# EAGLE design adc_breakout (EAGLE 9.5.2)
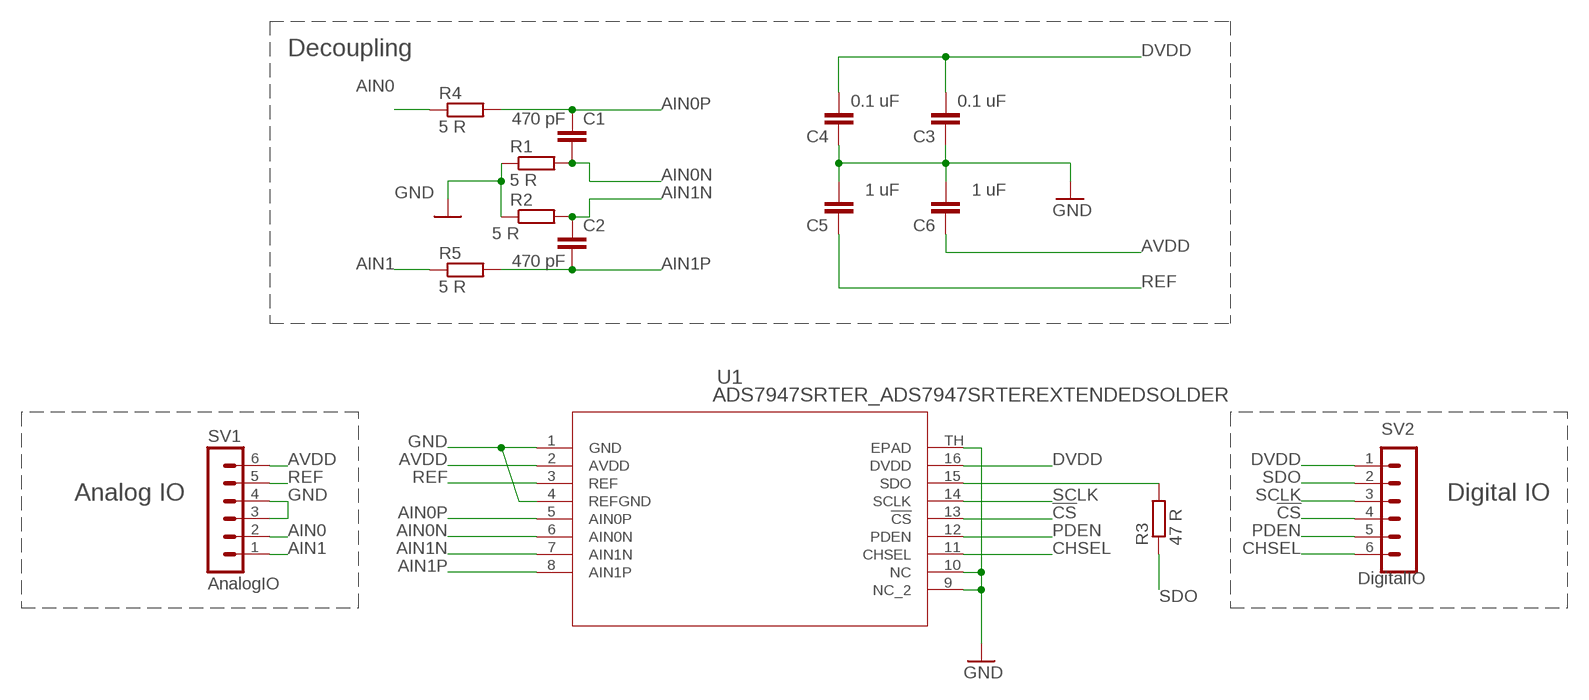
[diagram p0: schematic, sheet 1]

## Parts
C1  470 pF  C-EUC0603  [C0603]
C2  470 pF  C-EUC0603  [C0603]
C3  0.1 uF  C-EUC0603  [C0603]
C4  0.1 uF  C-EUC0603  [C0603]
C5  1 uF  C-EUC0603  [C0603]
C6  1 uF  C-EUC0603  [C0603]
R1  5 R  R-EU_R0603  [R0603]
R2  5 R  R-EU_R0603  [R0603]
R3  47 R  R-EU_R0603  [R0603]
R4  5 R  R-EU_R0603  [R0603]
R5  5 R  R-EU_R0603  [R0603]
SV1  AnalogIO  MA06-1  [MA06-1]
SV2  DigitalIO  MA06-1  [MA06-1]
U1  ADS7947SRTER_ADS7947SRTEREXTENDEDSOLDER  [QFN16-EXTENDEDPADS]

## Nets
!CS: SV2.4 U1.13(!CS)
AIN0: R4.1 SV1.2
AIN0N: C1.2 R1.2 U1.6(AIN0N)
AIN0P: C1.1 R4.2 U1.5(AIN0P)
AIN1: R5.1 SV1.1
AIN1N: C2.1 R2.2 U1.7(AIN1N)
AIN1P: C2.2 R5.2 U1.8(AIN1P)
AVDD: C6.1 SV1.6 U1.2(AVDD)
CHSEL: SV2.6 U1.11(CHSEL)
DVDD: C3.2 C4.2 SV2.1 U1.16(DVDD)
GND: C3.1 C4.1 C5.2 C6.2 R1.1 R2.1 SV1.3 SV1.4 U1.1(GND) U1.4(REFGND) U1.9(NC_2) U1.10(NC) U1.TH(EPAD)
N$1: R3.2 U1.15(SDO)
PDEN: SV2.5 U1.12(PDEN)
REF: C5.1 SV1.5 U1.3(REF)
SCLK: SV2.3 U1.14(SCLK)
SDO: R3.1 SV2.2

## Notes on the sheet
- Decoupling
- Digital IO
- Analog IO

## Library data of the parts
C1-C6 = rcl:C-EU: CAPACITOR, European symbol; SPICEPREFIX: C
R1-R5 = rcl:R-EU_: RESISTOR, European symbol; SPICEPREFIX: R
SV1 SV2 = con-lstb:MA06-1: PIN HEADER; OC_FARNELL: unknown; OC_NEWARK: unknown
U1 = spectrometer_mother_board_v1:ADS7947SRTER_ADS7947SRTER

## Board
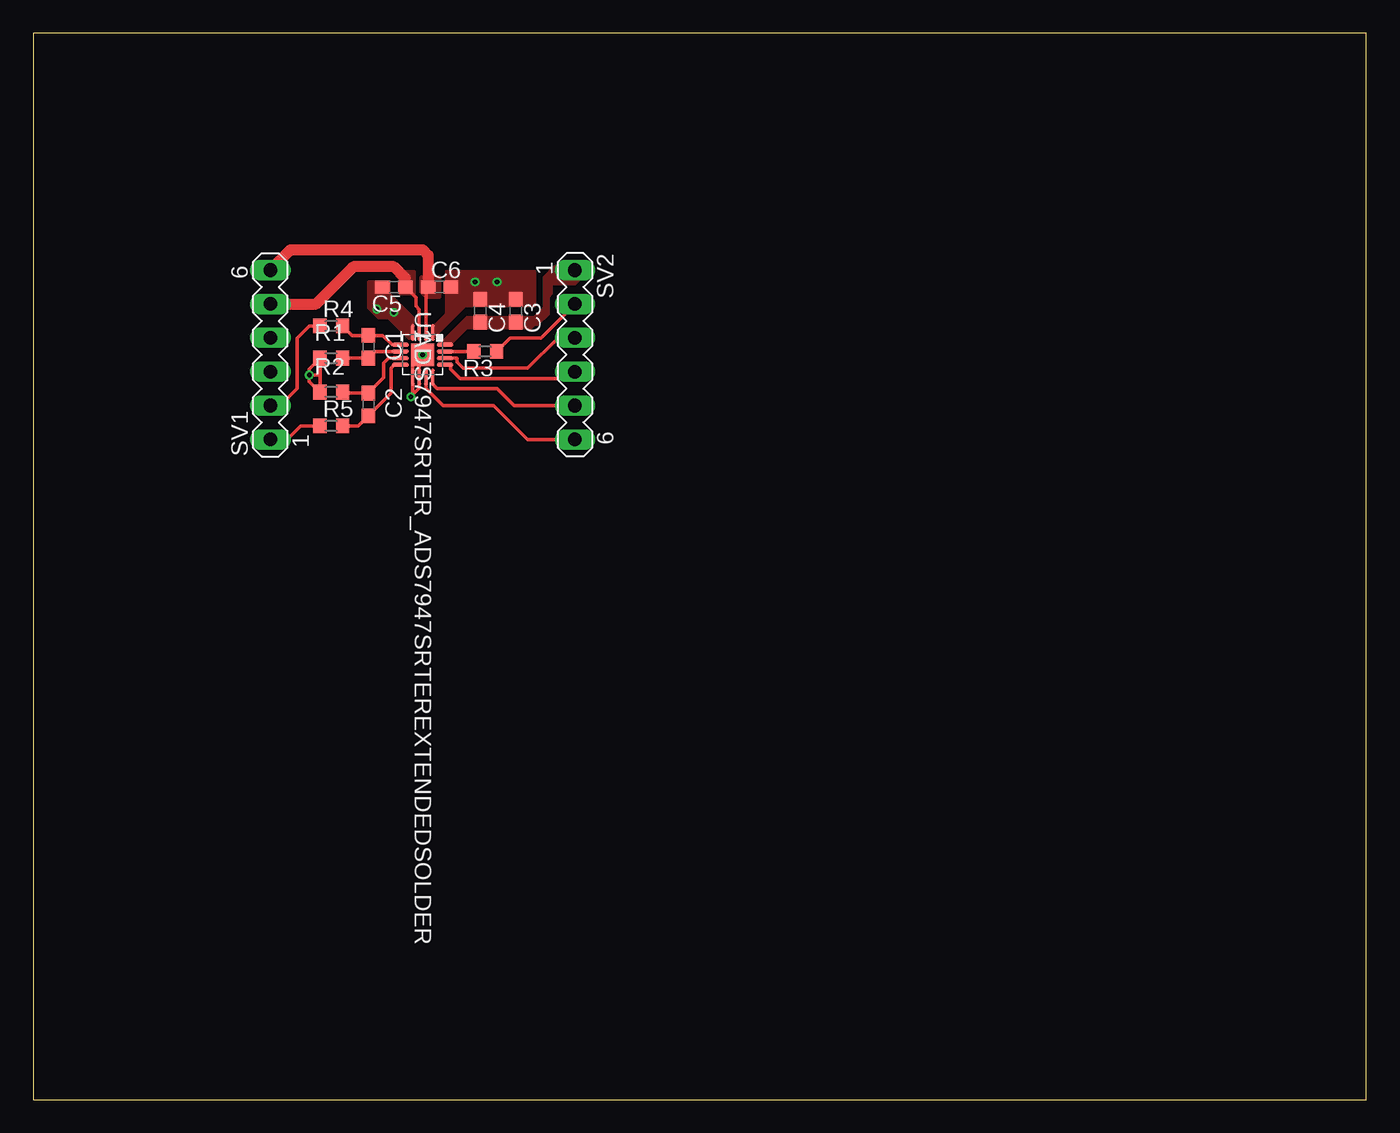
[diagram p1: board, top side]
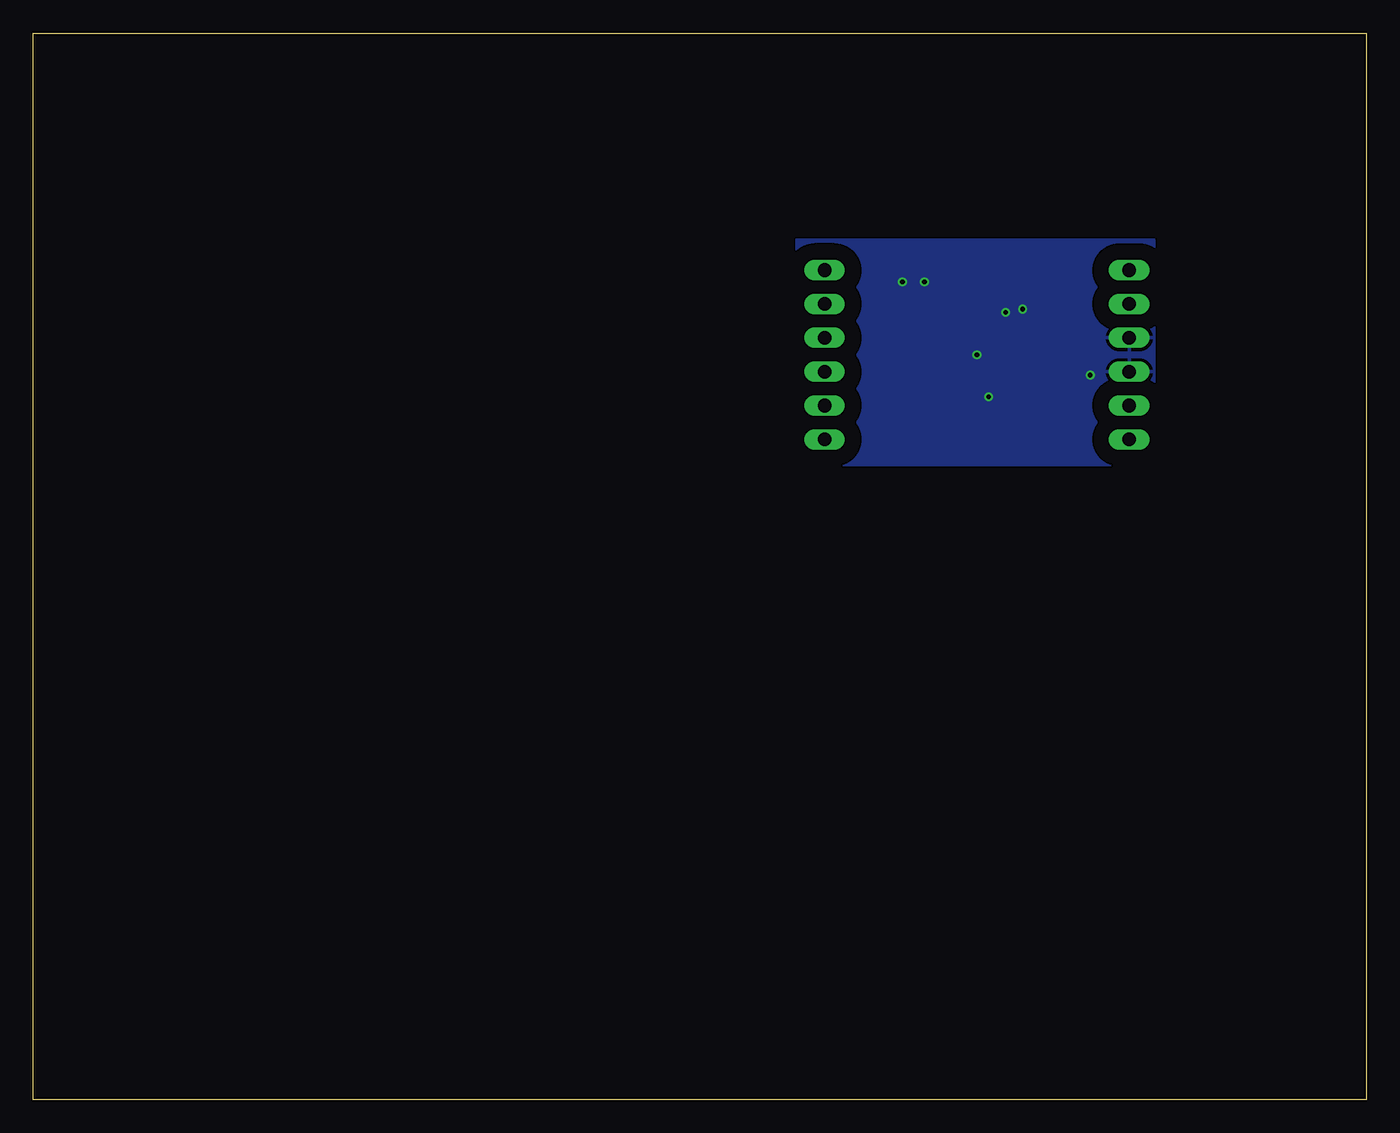
[diagram p2: board, bottom side, seen from below]

Size 100 x 80 mm. Coordinates in mm from the lower left corner, seen from the top.
Outline: 0,0 100,0 100,80 0,80 0,0
Copper layers (1*16): Top 0.035mm / dielectric 1.5mm / Bottom 0.035mm
Design rules "PCBWay_2layer": minimum track width 6mil, minimum drill 0.3mm, track to track 6mil, track to pad 6mil, pad to pad 6mil, via to via 6mil, smd to smd 4mil, copper to edge 10mil, drill to drill 6mil, minimum pad ring 6mil, minimum via ring 6mil, stop-mask expansion 4mil, vias tented up to drill 0.8mm, thermal gap 10mil

### Footprints (pad centres in the part's own frame; a part is rotated, then mirrored left to right if it is on the bottom)
C0603 = smd 1.1 x 1: 1 -0.85,0; 2 0.85,0
R0603 = smd 1 x 1.1: 1 -0.85,0; 2 0.85,0
MA06-1 = drill 1.016 long: 1 -6.35,0; 2 -3.81,0; 3 -1.27,0; 4 1.27,0; 5 3.81,0; 6 6.35,0
QFN16-EXTENDEDPADS = smd 1.25 x 0.3: 1 -1.675,0.75; 2 -1.675,0.25; 3 -1.675,-0.25; 4 -1.675,-0.75; 9 1.675,-0.75; 10 1.675,-0.25; 11 1.675,0.25; 12 1.675,0.75 | smd 0.3 x 1.25: 5 -0.75,-1.675; 6 -0.25,-1.675; 7 0.25,-1.675; 8 0.75,-1.675; 13 0.75,1.675; 14 0.25,1.675; 15 -0.25,1.675; 16 -0.75,1.675 | smd 1.7 x 1.7: TH 0,0

### Placement (x,y rotation side)
C1  25.15,56.48 270 top
C2  25.15,52.16 270 top
C3  36.2,59.18 270 top
C4  33.53,59.18 270 top
C5  27.05,60.96 180 top
C6  30.48,60.96 0 top
R1  22.35,55.63 0 top
R2  22.35,53.09 0 top
R3  33.91,56.13 180 top
R4  22.35,58.04 0 top
R5  22.35,50.55 0 top
SV1  17.78,55.88 90 top
SV2  40.64,55.88 270 top
U1  29.21,55.88 270 top

### Tracks (layer width: path | path; a pad name or v marks a point on that pad's centre or on a via)
!CS
  Top 0.254: SV2.4 40.13,54.1 32,54.1 31.32,54.79 31.32,55.07 31.26,55.13 U1.13
AIN0
  Top 0.254: R4.1 20.7,58.04 19.81,57.15 19.81,53.34 18.54,52.07 SV1.2
AIN0N
  Top 0.254: R1.2 C1.2 25.65,56.13 U1.6
AIN0P
  Top 0.254: R4.2 23.91,57.33 C1.1 26.21,57.33 26.91,56.63 U1.5
AIN1
  Top 0.254: R5.1 20.07,50.55 19.05,49.53 SV1.1
AIN1N
  Top 0.254: R2.2 23.28,53.01 C2.1 25.15,53.04 26.29,54.18 26.29,55.24 26.67,55.63 27.73,55.63 U1.7
AIN1P
  Top 0.254: R5.2 24.38,50.55 C2.2 26.84,53 26.84,54.88 27.09,55.13 U1.8
AVDD
  Top 0.254: C6.1 29.46,60.79 U1.2
  Top 0.813: SV1.6 19.3,63.75 29.21,63.75 29.63,63.33 C6.1
  pour Top (no thermals): 29.08,61.72 30.48,61.72 30.48,60.2 29.46,60.2 29.08,60.58
CHSEL
  Top 0.254: SV2.6 37.08,49.53 34.54,52.07 30.73,52.07 29.46,53.34 U1.11
DVDD
  pour Top (no thermals): 30.51,56.64 32.54,58.67 37.59,58.67 38.35,59.44 38.35,61.72 39.12,62.48 40.89,62.48 41.15,62.23 41.15,61.72 40.64,61.21 38.86,61.21 38.86,60.45 38.61,60.2 38.61,58.93 37.85,58.17 37.59,58.17 37.34,57.91 32.51,57.91 31.24,56.64
GND  (via drill 0.35, 0.35 pad 0.55)
  Top 0.254: 21.5,54.36 R1.1 20.7,54.83 v20.7,54.36 | 21.5,54.36 R2.1 20.7,53.89 v20.7,54.36 | v20.7,54.36 21.5,54.36 | U1.9 28.46,54.97 28.46,55.13 U1.TH 28.96,55.63 28.96,54.91 U1.10 28.96,53.37 v28.32,52.73 28.46,52.87 U1.9
  other vias: 25.78,59.31 27.05,59.05 33.15,61.34 34.8,61.34 29.21,55.88
  pour Bottom (isolate 1.27): 15.88,64.52 42.8,64.52 42.8,47.62 15.88,47.62
  pour Top (no thermals): 30.48,58.42 30.99,58.93 30.99,62.1 37.59,62.1 37.59,59.56 32.38,59.56 30.1,57.28 29.97,57.28 29.97,57.91
  pour Top (no thermals): 25.15,61.34 25.15,59.44 25.91,58.67 26.67,58.67 28.19,57.15 28.45,57.15 28.45,58.67 25.78,61.34
N$1
  Top 0.254: U1.15 R3.2
PDEN
  Top 0.254: SV2.5 36.07,52.07 34.8,53.34 30.3,53.34 29.96,53.68 U1.12
REF
  Top 0.254: C5.1 28.7,60.16 28.7,59.54 28.96,59.28 U1.3
  Top 0.61: 24,62.48 23.94,62.42
  Top 0.813: C5.1 27.9,61.63 27.05,62.48 24,62.48 | 23.94,62.42 21.21,59.69 SV1.5
  pour Top (no thermals): 27.56,62.1 27.56,60.45 28.57,60.45 28.57,62.1
SCLK
  Top 0.254: SV2.3 39.37,57.15 37.08,54.86 32.26,54.86 31.8,55.32 31.8,55.6 31.77,55.63 U1.14
SDO
  Top 0.254: SV2.2 38.1,57.15 35.77,57.15 R3.1